# EAGLE design tilt_brick (EAGLE 7.2.0)
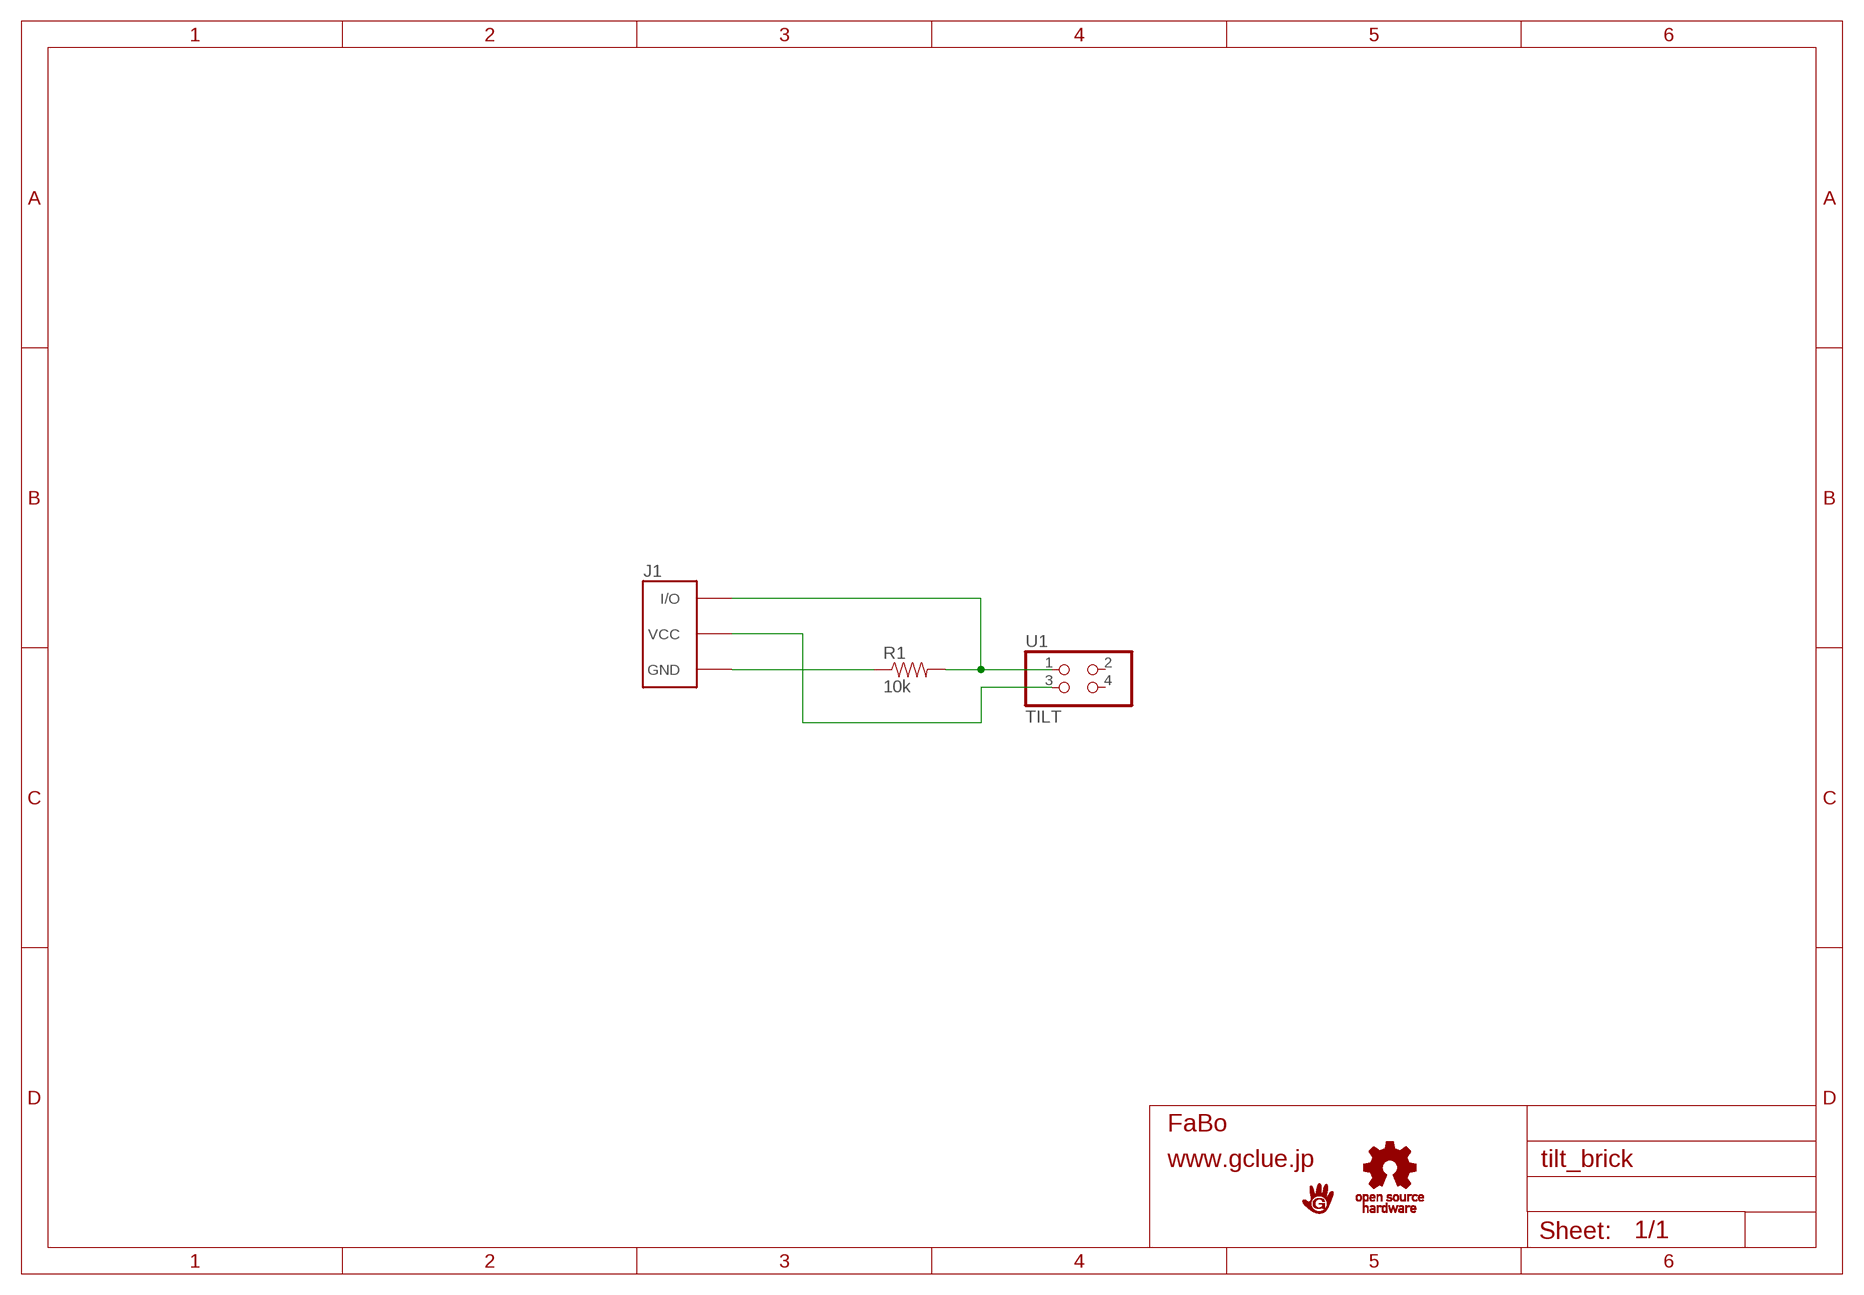
[diagram p0: schematic, sheet 1]

## Parts
J1  BRICK_3PIN  [BRICK_3PIN]
R1  10k  RESISTORKIT  [AXIAL-0.3-KIT]
U1  TILT  PINHD-2X2  [2X02]
U$2  LOGO_GCLUE-M  [LOGO_GCLUE_M]
U$3  LOGO_OSHW_T-M  [LOGO_OSHW_T_M]

## Nets
GND: J1.GND R1.P$1
N$3: J1.IN/OUT(I/O) R1.P$2 U1.1
N$5: J1.VCC U1.3
Unconnected: U1.2 U1.4

## Library data of the parts
J1 = Gclue:BRICK_3PIN: FaBo Brick 3pin
R1 = SparkFun:RESISTOR: Resistor Basic schematic elements and footprints for 0603, 1206, and PTH resistors.
U1 = pinhead:PINHD-2X2: PIN HEADER
U$2 = Gclue:LOGO_GCLUE
U$3 = Gclue:LOGO_OSHW_T

## Board
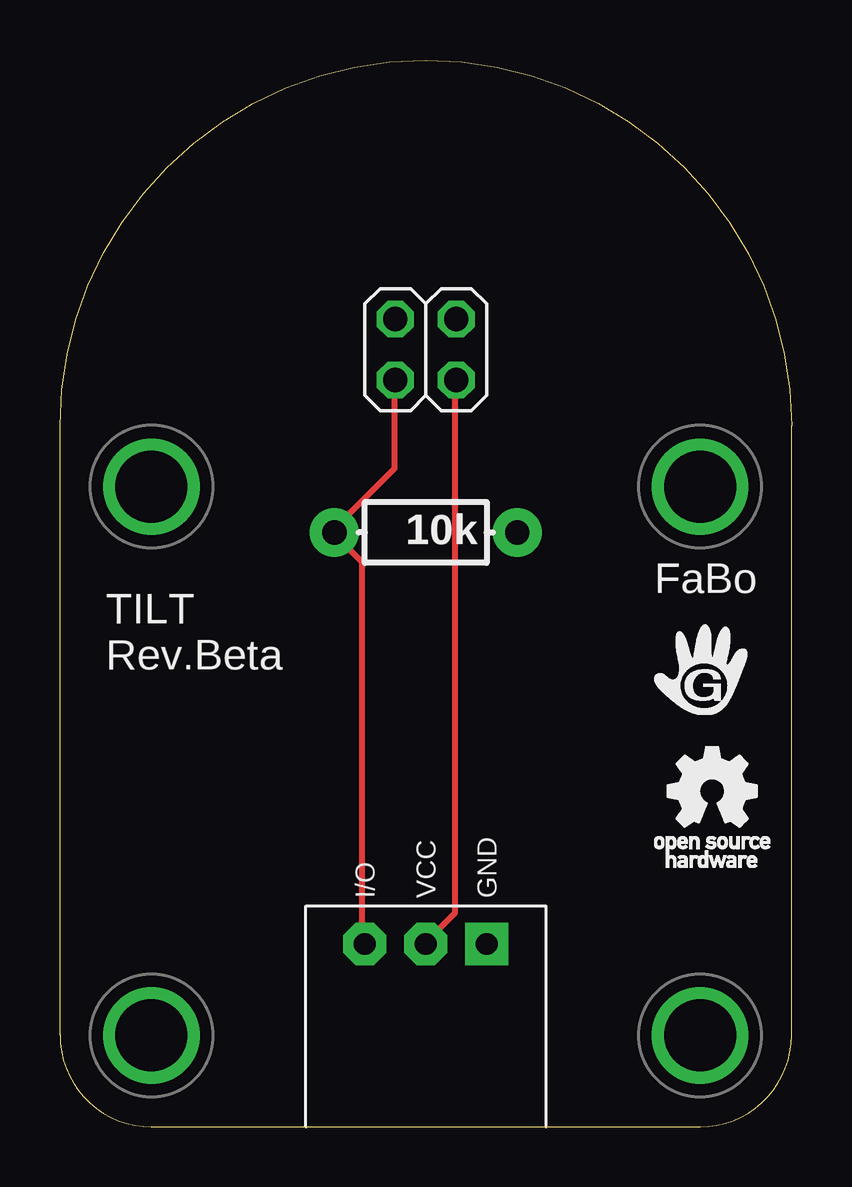
[diagram p1: board, top side]
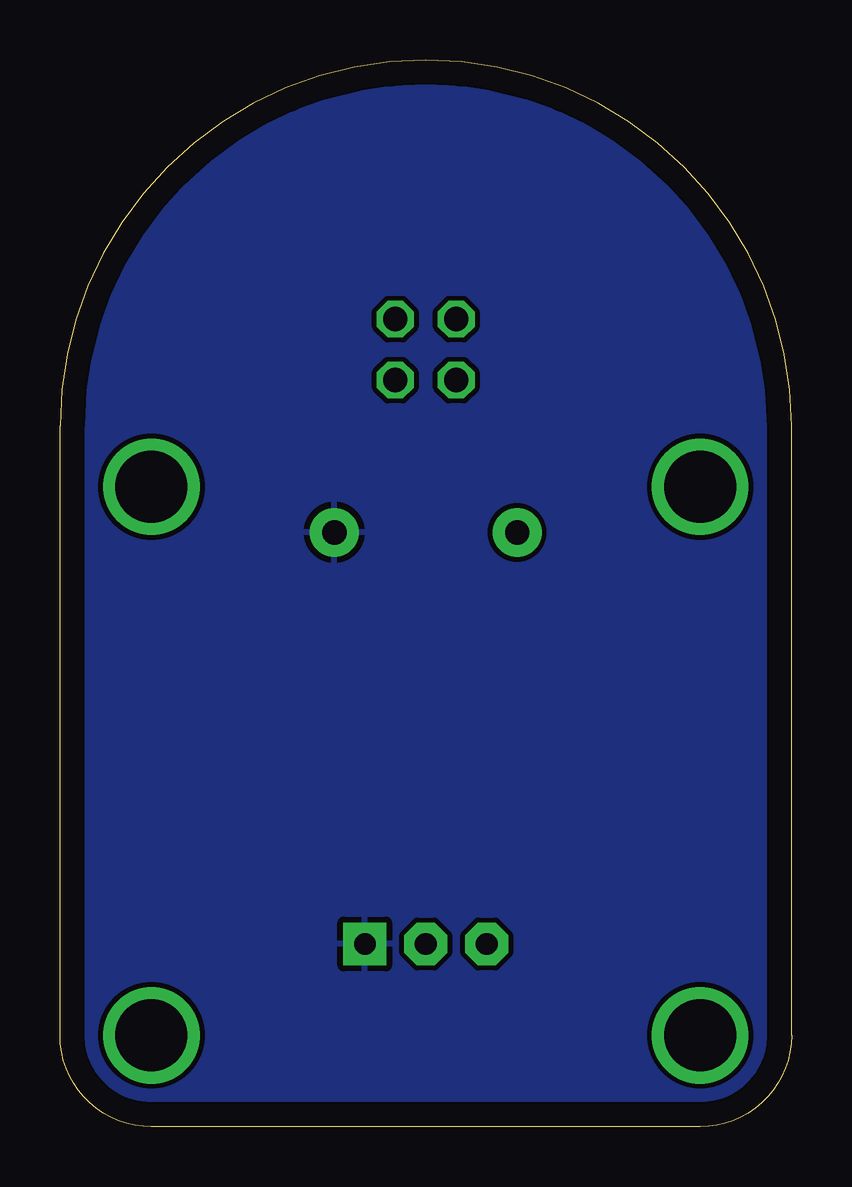
[diagram p2: board, bottom side, seen from below]

Size 30.48 x 44.45 mm. Coordinates in mm from the lower left corner, seen from the top.
Copper layers (1*16): Top 0.035mm / dielectric 1.5mm / Bottom 0.035mm
Design rules "default": minimum track width 10mil, minimum drill 24mil, track to track 8mil, track to pad 8mil, pad to pad 8mil, via to via 8mil, smd to smd 8mil, copper to edge 40mil, drill to drill 8mil, minimum pad ring 10mil, minimum via ring 8mil, stop-mask expansion 4mil, vias tented up to drill 0mil, thermal gap 10mil

### Footprints (pad centres in the part's own frame; a part is rotated, then mirrored left to right if it is on the bottom)
BRICK_3PIN = drill 0.9 pad 1.778 square: GND 2.54,-11.43 | drill 0.9 pad 1.778 octagon: IN/OUT -2.54,-11.43; VCC 0,-11.43 | drill 3 pad 3.81: P$1 -11.43,7.62; P$2 11.43,7.62; P$3 11.43,-15.24; P$4 -11.43,-15.24
AXIAL-0.3-KIT = drill 1.016 pad 2.032: P$1 -3.81,0; P$2 3.81,0
2X02 = drill 1.016 octagon: 1 -1.27,-1.27; 2 -1.27,1.27; 3 1.27,-1.27; 4 1.27,1.27

### Placement (x,y rotation side)
J1  15.24,19.05 0 top
R1  15.24,24.77 180 top
U1  15.24,32.38 0 top
U$2  26.67,19.05 0 top
U$3  27.3,13.34 0 top

### Tracks (layer width: path | path; a pad name or v marks a point on that pad's centre or on a via)
GND
  pour Bottom: 0,0 30.48,0 29.84,43.81 -0.64,44.45
N$3
  Top 0.254: U1.1 13.95,31.09 13.95,27.43 11.43,24.92 R1.P$2 11.43,24.69 12.57,23.55 12.57,7.77 J1.IN/OUT
N$5
  Top 0.254: U1.3 16.46,31.09 16.46,8.91 15.32,7.77 J1.VCC

### Text on the board
tPlace: FaBo | TILT / Rev.Beta